# EAGLE design R220L (EAGLE 6.6.0)
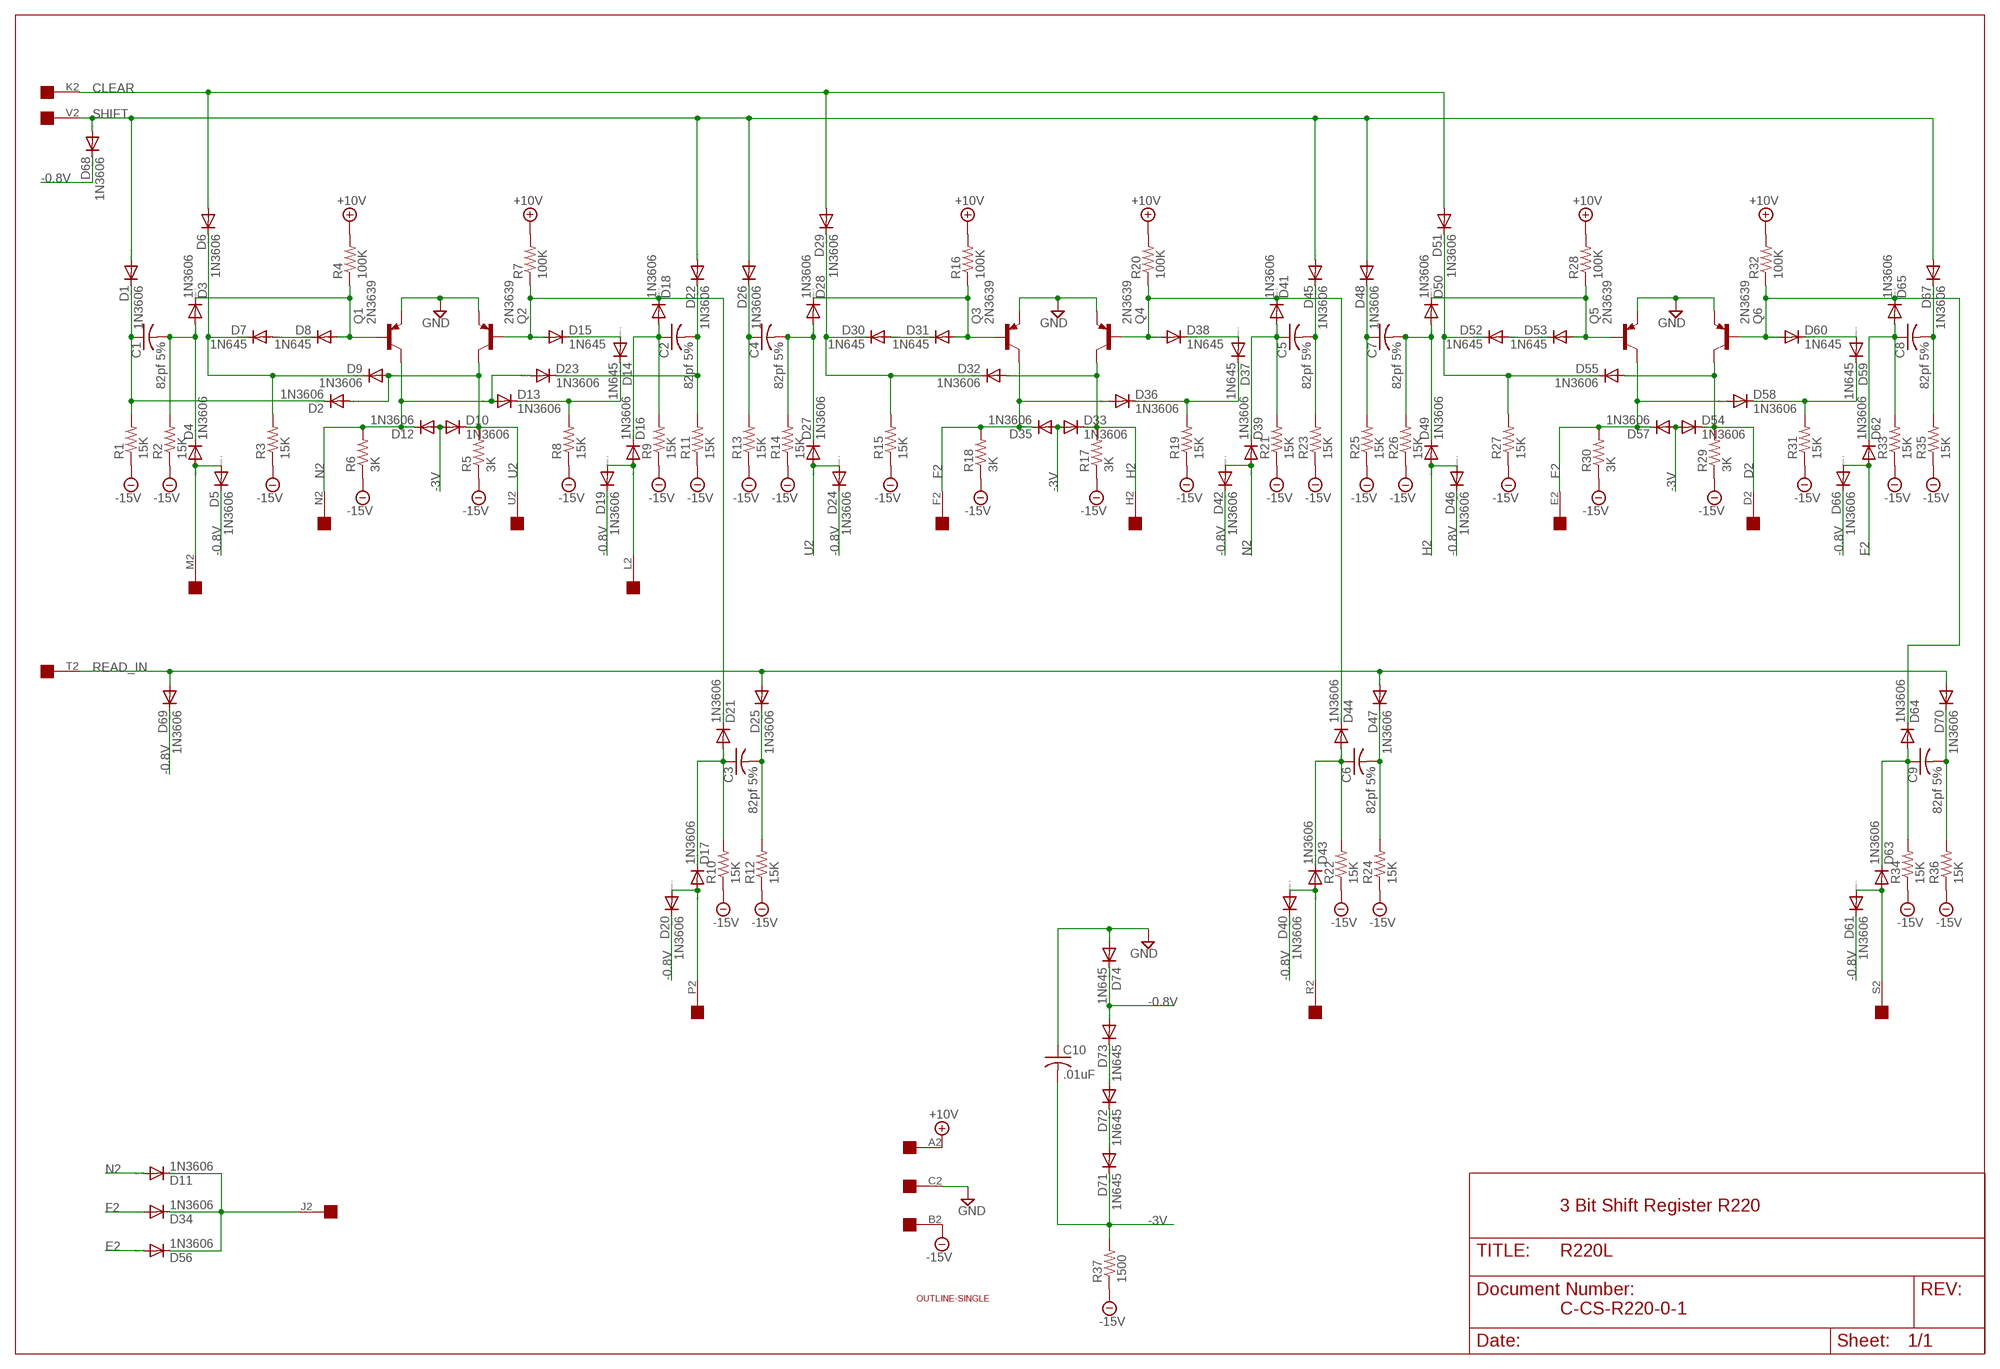
[diagram p0: schematic, sheet 1]

## Parts
C1  82pf 5%  C-US  [C063-025X075]
C2  82pf 5%  C-US  [C063-025X075]
C3  82pf 5%  C-US  [C063-025X075]
C4  82pf 5%  C-US  [C063-025X075]
C5  82pf 5%  C-US  [C063-025X075]
C6  82pf 5%  C-US  [C063-025X075]
C7  82pf 5%  C-US  [C063-025X075]
C8  82pf 5%  C-US  [C063-025X075]
C9  82pf 5%  C-US  [C063-025X075]
C10  .01uF  C-US  [C063-025X075]
D1  1N3606  1N4148DO35-10  [DO35-10]
D2  1N3606  1N4148DO35-10  [DO35-10]
D3  1N3606  1N4148DO35-10  [DO35-10]
D4  1N3606  1N4148DO35-10  [DO35-10]
D5  1N3606  1N4148DO35-10  [DO35-10]
D6  1N3606  1N4148DO35-10  [DO35-10]
D7  1N645  1N4148DO35-10  [DO35-10]
D8  1N645  1N4148DO35-10  [DO35-10]
D9  1N3606  1N4148DO35-10  [DO35-10]
D10  1N3606  1N4148DO35-10  [DO35-10]
D11  1N3606  1N4148DO35-10  [DO35-10]
D12  1N3606  1N4148DO35-10  [DO35-10]
D13  1N3606  1N4148DO35-10  [DO35-10]
D14  1N645  1N4148DO35-10  [DO35-10]
D15  1N645  1N4148DO35-10  [DO35-10]
D16  1N3606  1N4148DO35-10  [DO35-10]
D17  1N3606  1N4148DO35-10  [DO35-10]
D18  1N3606  1N4148DO35-10  [DO35-10]
D19  1N3606  1N4148DO35-10  [DO35-10]
D20  1N3606  1N4148DO35-10  [DO35-10]
D21  1N3606  1N4148DO35-10  [DO35-10]
D22  1N3606  1N4148DO35-10  [DO35-10]
D23  1N3606  1N4148DO35-10  [DO35-10]
D24  1N3606  1N4148DO35-10  [DO35-10]
D25  1N3606  1N4148DO35-10  [DO35-10]
D26  1N3606  1N4148DO35-10  [DO35-10]
D27  1N3606  1N4148DO35-10  [DO35-10]
D28  1N3606  1N4148DO35-10  [DO35-10]
D29  1N3606  1N4148DO35-10  [DO35-10]
D30  1N645  1N4148DO35-10  [DO35-10]
D31  1N645  1N4148DO35-10  [DO35-10]
D32  1N3606  1N4148DO35-10  [DO35-10]
D33  1N3606  1N4148DO35-10  [DO35-10]
D34  1N3606  1N4148DO35-10  [DO35-10]
D35  1N3606  1N4148DO35-10  [DO35-10]
D36  1N3606  1N4148DO35-10  [DO35-10]
D37  1N645  1N4148DO35-10  [DO35-10]
D38  1N645  1N4148DO35-10  [DO35-10]
D39  1N3606  1N4148DO35-10  [DO35-10]
D40  1N3606  1N4148DO35-10  [DO35-10]
D41  1N3606  1N4148DO35-10  [DO35-10]
D42  1N3606  1N4148DO35-10  [DO35-10]
D43  1N3606  1N4148DO35-10  [DO35-10]
D44  1N3606  1N4148DO35-10  [DO35-10]
D45  1N3606  1N4148DO35-10  [DO35-10]
D46  1N3606  1N4148DO35-10  [DO35-10]
D47  1N3606  1N4148DO35-10  [DO35-10]
D48  1N3606  1N4148DO35-10  [DO35-10]
D49  1N3606  1N4148DO35-10  [DO35-10]
D50  1N3606  1N4148DO35-10  [DO35-10]
D51  1N3606  1N4148DO35-10  [DO35-10]
D52  1N645  1N4148DO35-10  [DO35-10]
D53  1N645  1N4148DO35-10  [DO35-10]
D54  1N3606  1N4148DO35-10  [DO35-10]
D55  1N3606  1N4148DO35-10  [DO35-10]
D56  1N3606  1N4148DO35-10  [DO35-10]
D57  1N3606  1N4148DO35-10  [DO35-10]
D58  1N3606  1N4148DO35-10  [DO35-10]
D59  1N645  1N4148DO35-10  [DO35-10]
D60  1N645  1N4148DO35-10  [DO35-10]
D61  1N3606  1N4148DO35-10  [DO35-10]
D62  1N3606  1N4148DO35-10  [DO35-10]
D63  1N3606  1N4148DO35-10  [DO35-10]
D64  1N3606  1N4148DO35-10  [DO35-10]
D65  1N3606  1N4148DO35-10  [DO35-10]
D66  1N3606  1N4148DO35-10  [DO35-10]
D67  1N3606  1N4148DO35-10  [DO35-10]
D68  1N3606  1N4148DO35-10  [DO35-10]
D69  1N3606  1N4148DO35-10  [DO35-10]
D70  1N3606  1N4148DO35-10  [DO35-10]
D71  1N645  1N4148DO35-10  [DO35-10]
D72  1N645  1N4148DO35-10  [DO35-10]
D73  1N645  1N4148DO35-10  [DO35-10]
D74  1N645  1N4148DO35-10  [DO35-10]
Q1  2N3639  2N3637  [TO39]
Q2  2N3639  2N3637  [TO39]
Q3  2N3639  2N3637  [TO39]
Q4  2N3639  2N3637  [TO39]
Q5  2N3639  2N3637  [TO39]
Q6  2N3639  2N3637  [TO39]
R1  15K  R-US_0207/10  [0207/10]
R2  15K  R-US_0207/10  [0207/10]
R3  15K  R-US_0207/10  [0207/10]
R4  100K  R-US_0207/10  [0207/10]
R5  3K  R-US_0207/10  [0207/10]
R6  3K  R-US_0207/10  [0207/10]
R7  100K  R-US_0207/10  [0207/10]
R8  15K  R-US_0207/10  [0207/10]
R9  15K  R-US_0207/10  [0207/10]
R10  15K  R-US_0207/10  [0207/10]
R11  15K  R-US_0207/10  [0207/10]
R12  15K  R-US_0207/10  [0207/10]
R13  15K  R-US_0207/10  [0207/10]
R14  15K  R-US_0207/10  [0207/10]
R15  15K  R-US_0207/10  [0207/10]
R16  100K  R-US_0207/10  [0207/10]
R17  3K  R-US_0207/10  [0207/10]
R18  3K  R-US_0207/10  [0207/10]
R19  15K  R-US_0207/10  [0207/10]
R20  100K  R-US_0207/10  [0207/10]
R21  15K  R-US_0207/10  [0207/10]
R22  15K  R-US_0207/10  [0207/10]
R23  15K  R-US_0207/10  [0207/10]
R24  15K  R-US_0207/10  [0207/10]
R25  15K  R-US_0207/10  [0207/10]
R26  15K  R-US_0207/10  [0207/10]
R27  15K  R-US_0207/10  [0207/10]
R28  100K  R-US_0207/10  [0207/10]
R29  3K  R-US_0207/10  [0207/10]
R30  3K  R-US_0207/10  [0207/10]
R31  15K  R-US_0207/10  [0207/10]
R32  100K  R-US_0207/10  [0207/10]
R33  15K  R-US_0207/10  [0207/10]
R34  15K  R-US_0207/10  [0207/10]
R35  15K  R-US_0207/10  [0207/10]
R36  15K  R-US_0207/10  [0207/10]
R37  1500  R-US_0207/10  [0207/10]
U$1  OUTLINE-SINGLE  [SINGLE]
U$2  EDGE-1  [EDGE-CON1]

## Nets
+10V [Power]: R4.2 R7.2 R16.2 R20.2 R28.2 R32.2 U$2.A2
-0.8V [Power]: D5.C D19.C D20.C D24.C D40.C D42.C D46.C D61.C D66.C D68.C D69.C D73.A D74.C
-3V [Power]: C10.2 D10.A D12.A D33.A D35.A D54.A D57.A D71.C R37.2
-15V [Power]: R1.1 R2.1 R3.1 R5.1 R6.1 R8.1 R9.1 R10.1 R11.1 R12.1 R13.1 R14.1 R15.1 R17.1 R18.1 R19.1 R21.1 R22.1 R23.1 R24.1 R25.1 R26.1 R27.1 R29.1 R30.1 R31.1 R33.1 R34.1 R35.1 R36.1 R37.1 U$2.B2
CLEAR: D6.A D29.A D51.A U$2.K2
D2: D54.C D55.A Q6.3(C) R29.2 U$2.D2
E2: D56.A D57.C D58.A Q5.3(C) R30.2 U$2.E2
F2: D34.A D35.C D36.A D62.A D66.A Q3.3(C) R18.2 U$2.F2
GND [Power]: C10.1 D74.A Q1.1(E) Q2.1(E) Q3.1(E) Q4.1(E) Q5.1(E) Q6.1(E) U$2.C2
H2: D32.A D33.C D46.A D49.A Q4.3(C) R17.2 U$2.H2
N2: D11.A D12.C D13.A D23.A D39.A D42.A Q1.3(C) R6.2 U$2.N2
N$1: D30.A D31.C
N$2: C2.2 D22.C D23.C R11.2
N$3: D29.C D30.C D32.C R15.2
N$4: C1.1 D1.C D2.C R1.2
N$6: D14.A D15.C
N$7: C1.2 D3.A D4.C R2.2
N$8: C2.1 D16.C D18.A R9.2
N$9: D6.C D7.C D9.C R3.2
N$10: D4.A D5.A U$2.M2
N$11: D28.C D31.A Q3.2(B) R16.1
N$12: D13.C D14.C R8.2
N$13: D37.A D38.C
N$14: D3.C D8.A Q1.2(B) R4.1
N$15: D38.A D41.C D44.C Q4.2(B) R20.1
N$16: D36.C D37.C R19.2
N$17: D15.A D18.C D21.C Q2.2(B) R7.1
N$18: C4.1 D26.C R13.2
N$19: C4.2 D27.C D28.A R14.2
N$22: C5.1 D39.C D41.A R21.2
N$23: D7.A D8.C
N$24: D11.C D34.C D56.C U$2.J2
N$25: C5.2 D45.C R23.2
N$27: D52.A D53.C
N$28: D51.C D52.C D55.C R27.2
N$29: D50.C D53.A Q5.2(B) R28.1
N$30: D59.A D60.C
N$31: D60.A D64.C D65.C Q6.2(B) R32.1
N$32: D16.A D19.A U$2.L2
N$33: D58.C D59.C R31.2
N$34: C7.1 D48.C R25.2
N$35: C7.2 D49.C D50.A R26.2
N$36: D71.A D72.C
N$39: C8.1 D62.C D65.A R33.2
N$40: C8.2 D67.C R35.2
N$41: D72.A D73.C
N$43: C3.1 D17.C D21.A R10.2
N$44: C3.2 D25.C R12.2
N$46: C6.1 D43.C D44.A R22.2
N$47: C6.2 D47.C R24.2
N$50: C9.1 D63.C D64.A R34.2
N$51: C9.2 D70.C R36.2
P2: D17.A D20.A U$2.P2
R2: D40.A D43.A U$2.R2
READ_IN: D25.A D47.A D69.A D70.A U$2.T2
S2: D61.A D63.A U$2.S2
SHIFT: D1.A D22.A D26.A D45.A D48.A D67.A D68.A U$2.V2
U2: D2.A D9.A D10.C D24.A D27.A Q2.3(C) R5.2 U$2.U2

## Notes on the sheet
- 3 Bit Shift Register R220
- C-CS-R220-0-1

## Library data of the parts
C1-C10 = dec-con:C-US: Capacitors with funky DEC lead spacing.
D1-D74 = diode:1N4148: DIODE high speed (Philips)
Q1-Q6 = transistor-pnp:2N3637*: PNP Transistror
R1-R37 = rcl:R-US_: RESISTOR, American symbol
U$1 = dec-con:OUTLINE-*: Board outlines for DEC boards.
U$2 = dec-con:EDGE-1: Single-Sided DEC Edge Connector -- (side 2)

## Net classes
1 Power: width 0.813 mm

## Board
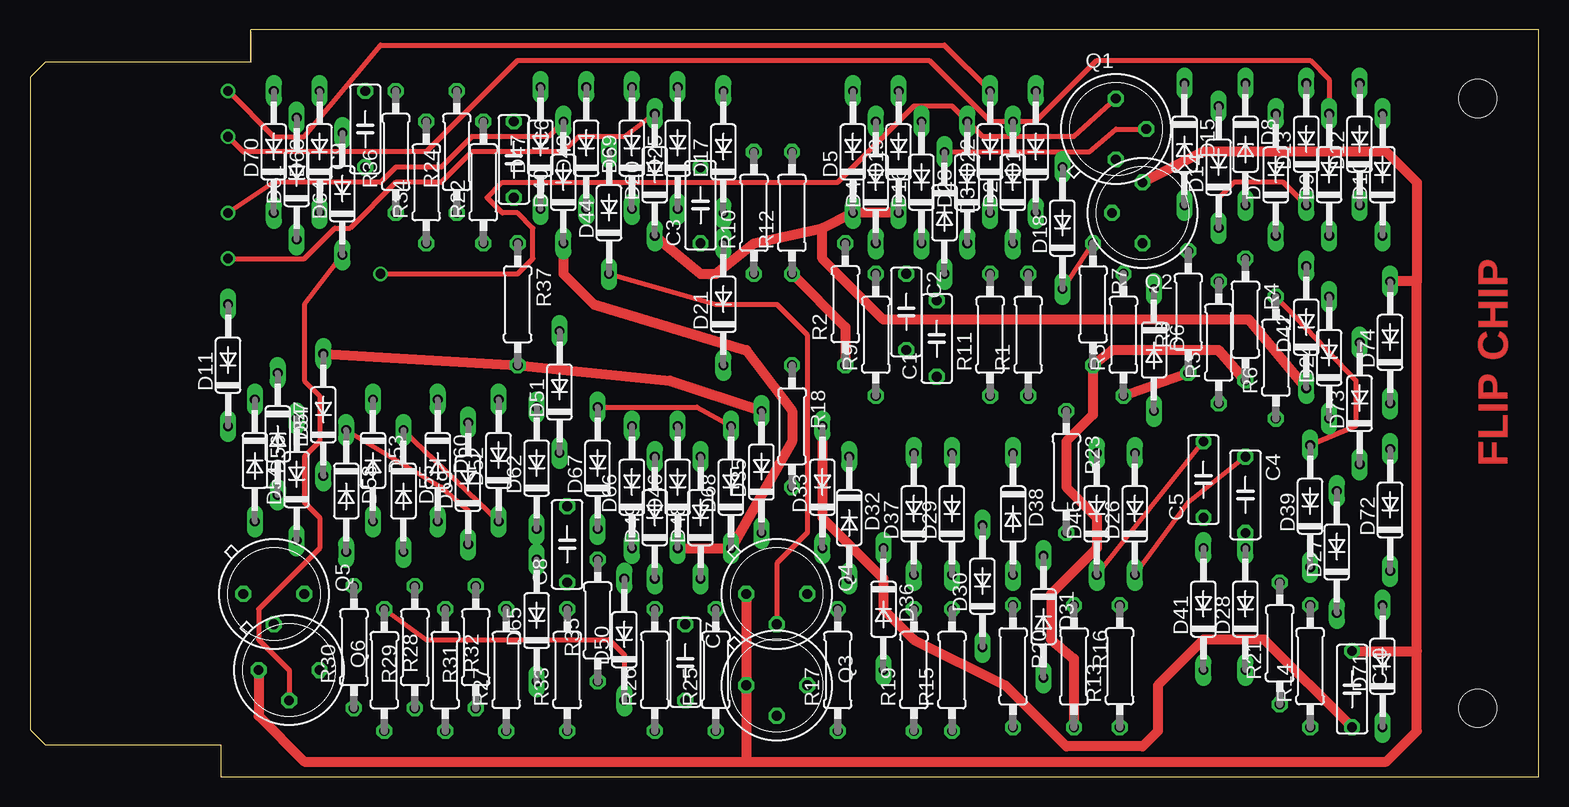
[diagram p1: board, top side]
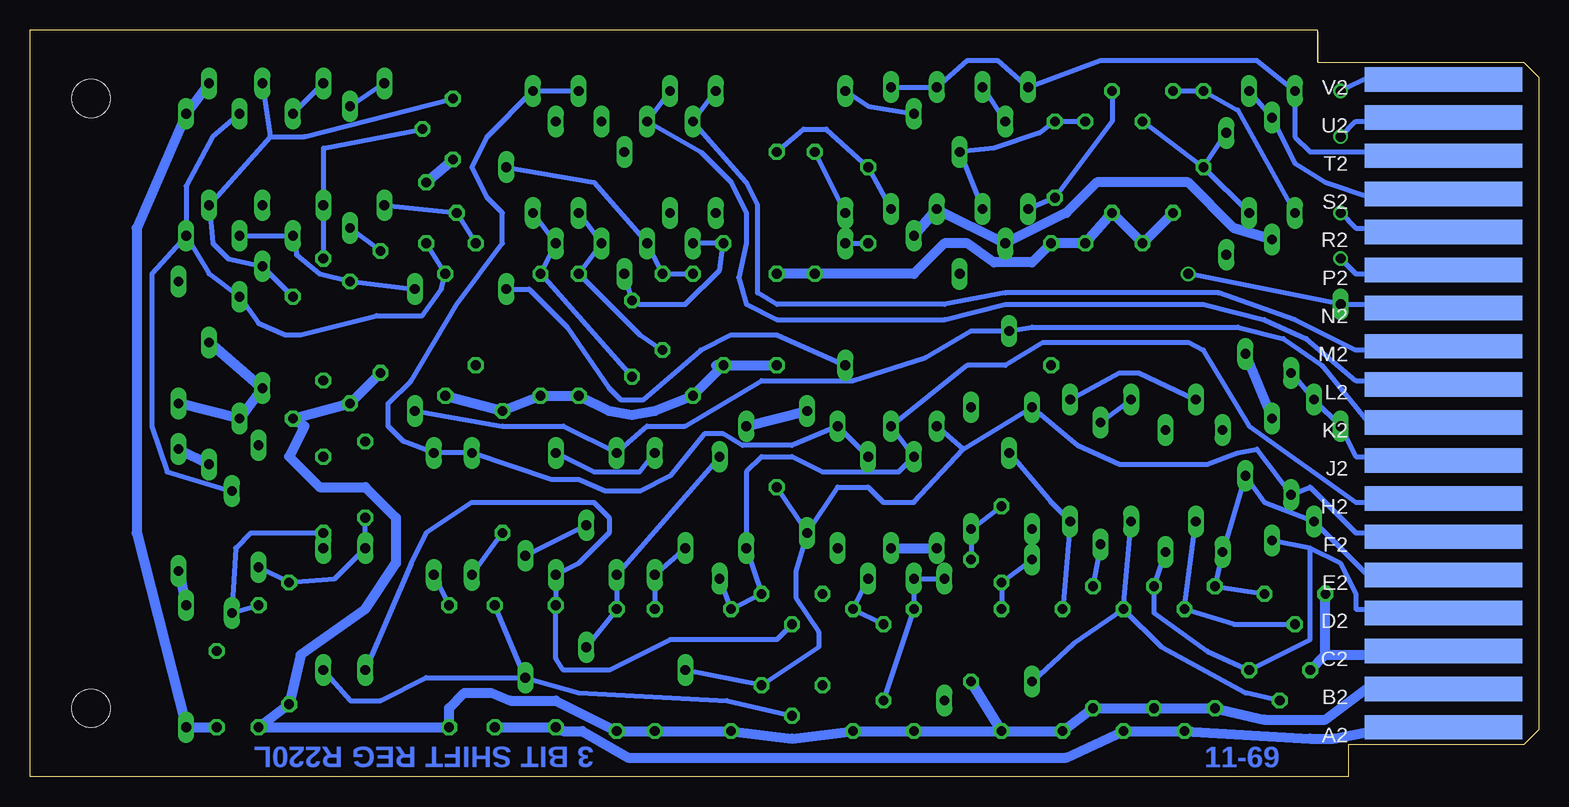
[diagram p2: board, bottom side, seen from below]

Size 125.73 x 62.23 mm. Coordinates in mm from the lower left corner, seen from the top.
Copper layers (1+16): Top 0.035mm / dielectric 1.5mm / Bottom 0.035mm
Design rules "16mils": minimum track width 16mil, minimum drill 32mil, track to track 15mil, track to pad 10mil, pad to pad 10mil, via to via 10mil, smd to smd 10mil, copper to edge 13mil, drill to drill 10mil, minimum pad ring 10mil, minimum via ring 8mil, stop-mask expansion 0mil, vias tented up to drill 0mil, thermal gap 10mil

### Footprints (pad centres in the part's own frame; a part is rotated, then mirrored left to right if it is on the bottom)
C063-025X075 = drill 0.813 octagon: 1 -2.54,0; 2 3.81,0
DO35-10 = drill 0.813 long: A 5.08,0; C -5.08,0
TO39 = drill 0.813 octagon: 1 0,-2.54; 2 2.54,0; 3 0,2.54
0207/10 = drill 0.813 octagon: 1 -5.08,0; 2 5.08,0
SINGLE = hole 3.175: 120.65,56.515; 120.65,5.715
EDGE-CON1 = smd 13.106 x 2.032 bottom: A2 7.938,4.128; B2 7.938,7.303; C2 7.938,10.477; D2 7.938,13.652; E2 7.938,16.828; F2 7.938,20.003; H2 7.938,23.177; J2 7.938,26.352; K2 7.938,29.527; L2 7.938,32.703; M2 7.938,35.877; N2 7.938,39.053; P2 7.938,42.227; R2 7.938,45.403; S2 7.938,48.578; T2 7.938,51.752; U2 7.938,54.928; V2 7.938,58.102

### Placement (x,y rotation side)
C1  75.57,35.88 90 top
C2  73.03,39.37 270 top
C3  55.88,46.99 90 top
C4  101.28,24.13 270 top
C5  97.79,24.13 90 top
C6  40.32,52.07 270 top
C7  54.61,10.16 270 top
C8  44.77,18.73 90 top
C9  27.94,53.34 90 top
C10  110.17,7.94 270 top
D1  83.82,52.07 90 top
D2  81.92,49.53 90 top
D3  76.2,46.99 270 top
D4  70.49,49.53 90 top
D5  68.58,52.07 90 top
D6  93.66,35.56 270 top
D7  103.82,50.16 90 top
D8  101.28,52.7 270 top
D9  108.27,50.16 90 top
D10  112.71,50.16 90 top
D11  16.51,34.29 90 top
D12  110.81,52.7 90 top
D13  106.36,52.7 90 top
D14  99.06,50.8 90 top
D15  96.2,52.7 270 top
D16  74.3,49.53 90 top
D17  57.79,52.07 90 top
D18  86.04,45.72 90 top
D19  72.39,52.07 90 top
D20  52.07,50.16 90 top
D21  57.79,39.37 90 top
D22  80.01,52.07 90 top
D23  78.11,49.53 90 top
D24  108.27,34.92 90 top
D25  53.98,52.39 90 top
D26  92.08,21.91 90 top
D27  108.9,18.73 90 top
D28  101.28,13.97 90 top
D29  76.84,21.91 90 top
D30  79.38,15.88 90 top
D31  84.46,13.34 270 top
D32  68.26,21.59 270 top
D33  66.04,24.13 90 top
D34  20.64,28.57 270 top
D35  60.96,25.4 90 top
D36  71.12,13.97 270 top
D37  73.66,21.91 90 top
D38  81.92,21.91 270 top
D39  106.68,22.54 90 top
D40  44.45,49.53 90 top
D41  97.79,13.97 90 top
D42  106.36,37.47 90 top
D43  46.36,52.39 90 top
D44  48.26,46.99 90 top
D45  88.9,21.91 90 top
D46  53.98,24.13 90 top
D47  42.55,52.39 90 top
D48  55.88,21.59 90 top
D49  52.07,21.59 90 top
D50  49.53,11.43 90 top
D51  44.13,32.07 90 top
D52  39.05,26.35 90 top
D53  28.58,26.35 270 top
D54  22.23,24.77 90 top
D55  31.12,23.81 270 top
D56  18.73,26.35 270 top
D57  24.45,30.16 90 top
D58  26.35,23.81 270 top
D59  36.51,24.45 90 top
D60  33.97,26.35 270 top
D61  22.23,49.85 90 top
D62  42.23,25.72 90 top
D63  24.13,52.07 90 top
D64  26.04,48.58 90 top
D65  42.23,13.02 90 top
D66  50.17,24.13 90 top
D67  47.31,25.72 90 top
D68  58.42,24.13 90 top
D69  50.17,52.39 90 top
D70  20.32,52.07 90 top
D71  112.71,9.21 90 top
D72  113.35,22.23 90 top
D73  110.81,31.11 90 top
D74  113.35,36.2 90 top
Q1  90.49,53.98 0 top
Q2  92.71,46.99 180 top
Q3  62.23,7.62 270 top
Q4  62.23,15.24 270 top
Q5  20.32,15.24 270 top
Q6  21.59,8.89 270 top
R1  83.19,36.83 90 top
R2  67.95,39.37 90 top
R3  99.06,36.2 90 top
R4  101.28,38.1 270 top
R5  91.12,36.83 90 top
R6  103.82,34.92 90 top
R7  88.58,39.37 270 top
R8  96.52,38.73 90 top
R9  70.49,36.83 90 top
R10  60.33,46.99 90 top
R11  80.01,36.83 90 top
R12  63.5,46.99 90 top
R13  90.81,9.21 90 top
R14  106.68,9.21 90 top
R15  76.84,8.89 90 top
R16  87,9.21 270 top
R17  67.31,8.89 90 top
R18  63.5,29.21 270 top
R19  73.66,8.89 90 top
R20  81.92,9.21 270 top
R21  104.14,11.11 90 top
R22  37.78,49.53 90 top
R23  86.36,25.4 270 top
R24  35.56,52.07 90 top
R25  57.15,8.89 90 top
R26  52.07,8.89 90 top
R27  39.69,8.89 90 top
R28  29.53,8.89 270 top
R29  32.07,10.79 90 top
R30  26.99,10.79 90 top
R31  37.15,10.79 90 top
R32  34.61,8.89 270 top
R33  44.77,8.89 90 top
R34  33.02,49.53 90 top
R35  47.31,13.02 90 top
R36  30.48,52.07 90 top
R37  40.64,39.37 270 top
U$1  0,0 0 top
U$2  0,0 0 top
U$3  [FLIPCHIP]  125.73,62.23 180 top

### Tracks (layer width: path | path; a pad name or v marks a point on that pad's centre or on a via)
+10V
  Top 0.813: R4.2 99.06,35.56 90.17,35.56 R7.2 88.58,30.16 86.36,27.94 86.36,24.13 88.9,21.59 88.9,19.05 85.09,15.24 85.09,11.43 87,9.84 R16.2
  Bottom 0.813: U$2.A2 8.89,4.19 8.89,3.81 13.97,3.81 17.15,3.17 19.05,3.17 R28.2 R32.2 39.37,1.59 75.88,1.59 79.69,3.81 81.28,3.81 R20.2 R16.2
-0.8V
  Top 0.813: D46.C D68.C 63.5,27.94 63.5,30.48 59.69,35.56 46.99,39.37 44.45,41.91 D40.C | D19.C D5.C 66.04,45.72 | D20.C 55.88,41.91 57.15,41.91 60.33,44.45 66.04,45.72 | D42.C 101.6,38.1 71.12,38.1 66.04,43.18 66.04,45.72
  Bottom 0.813: D46.C D66.C | D20.C D69.C D40.C 39.37,46.99 36.83,49.53 29.21,49.53 25.4,45.72 D61.C | D73.A D42.C D24.C D74.C
-3V
  Top 0.813: D57.A R37.2 53.34,33.02 D35.A | D33.A 66.04,21.59 71.12,16.51 71.12,13.97 73.66,11.43 81.28,7.62 83.82,5.08 86.36,2.54 92.71,2.54 93.98,3.81 93.98,7.62 97.79,11.43 102.87,11.43 C10.2
  Bottom 0.813: D57.A D54.A | C10.2 D71.C 116.84,20.32 116.84,45.72 D10.A D12.A | D33.A D35.A
-15V
  Top 0.813: R12.1 67.95,37.47 R2.1 | R5.1 R8.1
  Bottom 0.813: U$2.B2 8.6,7.33 8.89,7.62 13.97,7.62 17.78,4.76 22.86,4.76 R30.1 R29.1 R31.1 R27.1 R33.1 | R33.1 R35.1 | R33.1 R26.1 R25.1 62.23,3.17 R17.1 R19.1 R15.1 81.92,6.35 85.73,6.35 87.31,6.99 89.54,6.99 90.81,5.71 R13.1 R14.1 R21.1 103.19,10.16 97.79,13.97 95.25,17.78 95.25,21.59 97.79,24.13 101.6,24.13 104.14,26.67 102.87,29.21 R6.1 R3.1 R8.1 | R36.1 R34.1 R24.1 R22.1 R37.1 42.23,42.86 45.4,42.86 47.63,44.45 49.53,44.45 52.07,41.91 R10.1 R12.1 | R2.1 68.58,34.29 | R2.1 R18.1 | R2.1 R9.1 73.66,30.48 75.57,30.16 77.47,30.48 R11.1 R1.1 R23.1 R5.1
CLEAR
  Bottom 0.406: U$2.K2 8.89,29.21 13.97,29.21 18.1,34.29 21.27,36.51 25.08,37.47 42.23,37.47 D51.A 47.31,37.15 51.12,34.92 57.15,33.02 64.77,33.02 71.12,29.21 74.3,29.21 D29.A 81.28,29.21 86.36,29.21 D6.A
D2
  Bottom 0.406: U$2.D2 8.59,13.66 8.89,13.97 15.24,13.97 15.24,15.24 16.51,17.78 19.05,19.05 | 19.05,19.05 19.05,11.43 Q6.3 27.62,10.48 32.07,13.65 R29.2 D55.A | 19.05,19.05 D54.C
E2
  Bottom 0.406: U$2.E2 8.56,16.84 8.89,16.51 13.97,16.51 D56.A 22.86,22.86 D57.C D58.A R30.2 Q5.3
F2
  Bottom 0.406: U$2.F2 8.89,20.32 15.24,20.32 19.05,24.13 D34.A 23.5,27.3 25.08,26.99 27.62,26.04 34.93,26.04 38.42,27.62 D62.A 47.94,27.3 | D36.A Q3.3 60.01,10.79 60.01,12.06 61.91,14.92 61.91,17.14 D35.C | R18.2 D35.C | D35.C 58.42,24.13 55.88,24.13 54.61,22.86 52.07,22.86 47.94,27.3 | 47.94,27.3 D66.A
GND
  Top 0.813: 115.57,41.27 115.57,49.53 113.03,52.07 97.79,52.07 Q2.1 | 115.57,41.27 D74.A | C10.1 115.57,10.48 | 115.57,10.48 115.57,41.27 | Q6.1 19.05,5.08 22.86,1.27 59.69,1.27 | 59.69,1.27 113.03,1.27 115.57,3.81 115.57,10.48 | Q4.1 Q3.1 59.69,1.27
  Bottom 0.813: U$2.C2 8.56,10.49 8.89,10.16 17.78,10.16 | Q6.1 17.78,10.16 | 17.78,10.16 Q5.1 | Q2.1 Q1.1
H2
  Bottom 0.406: U$2.H2 10.16,22.86 15.24,22.86 24.13,29.21 27.94,35.56 29.21,36.2 41.28,36.2 44.45,34.29 47.63,34.29 D46.A D49.A 53.34,25.4 59.69,25.4 62.23,26.67 64.77,26.67 66.04,25.4 D33.C Q4.3 R17.2 D32.A
N2  (via drill 0.81)
  Top 0.406: R6.2 110.49,33.02 110.49,29.21 D39.A | v29.21,41.91 40.64,41.91 41.91,43.18 41.91,45.72 40.64,46.99 39.37,46.99 38.1,48.26 39.37,49.53 67.31,49.53 73.66,55.88 76.84,55.88 D23.A 79.38,53.34 87,53.34 Q1.3
  Bottom 0.406: U$2.N2 8.89,39.37 D11.A v29.21,41.91 | 105.73,53.34 D12.C 110.49,44.45 109.22,43.18 D42.A R6.2 | Q1.3 102.87,53.34 105.73,53.34 | D13.A 105.73,53.34
N$1
  Bottom 0.406: D31.C D30.A
N$2
  Bottom 0.406: C2.2 74.93,36.83 R11.2 D23.C D22.C
N$3
  Bottom 0.406: D30.C R15.2 D29.C D32.C
N$4
  Bottom 0.406: C1.1 R1.2 D2.C D1.C
N$6
  Bottom 0.406: D15.C D14.A
N$7
  Bottom 0.406: D4.C R2.2 68.26,42.23 71.12,39.37 74.93,39.37 C1.2 D3.A
N$8
  Bottom 0.406: R9.2 C2.1 D16.C 78.74,49.53 D18.A
N$9
  Bottom 0.406: D9.C D7.C 103.51,43.5 101.6,41.91 R3.2 D6.C
N$10
  Bottom 0.406: D5.A D4.A 66.04,49.53 65.09,47.62 65.09,40.32 63.5,39.37 49.53,39.37 44.45,40.32 26.67,40.32 20.32,38.1 15.24,35.56 10.16,35.56 U$2.M2
N$11
  Bottom 0.406: Q3.2 67.63,6.35 80.01,6.99 D31.A | D31.A 92.71,8.26 96.52,6.35 99.06,6.35 D28.C | D31.A R16.1
N$12
  Top 0.406: D14.C 99.06,48.26 100.33,49.53 104.46,49.53 D13.C
  Bottom 0.406: D14.C R8.2
N$13
  Bottom 0.406: D38.C 78.74,25.4 74.93,25.4 D37.A
N$14
  Top 0.406: D3.C 88.27,52.07 90.49,53.98 Q1.2
  Bottom 0.406: R4.1 D8.A 101.28,52.39 Q1.2
N$15
  Top 0.406: D44.C 57.15,39.37 62.23,39.37 64.77,36.83 64.77,20.32 62.23,17.78 Q4.2
  Bottom 0.406: D41.C 93.98,17.78 92.71,20.32 88.9,22.86 78.74,22.86 77.47,21.59 77.47,20.32 80.01,17.78 D38.A R20.1 81.92,9.84 81.28,8.89 77.47,8.89 72.39,11.43 63.5,11.43 Q4.2
N$16
  Bottom 0.406: D36.C D37.C R19.2
N$17
  Top 0.406: D18.C R7.1
  Bottom 0.406: R7.1 Q2.2 D15.A | D18.C 84.14,40.64 80.96,37.47 77.47,32.38 76.52,31.43 74.61,31.43 69.85,35.56 67.31,36.83 63.5,36.83 D21.C
N$18
  Top 0.406: D26.C 96.52,22.86 C4.1
  Bottom 0.406: D26.C R13.2
N$19
  Bottom 0.406: R14.2 D27.C 108.59,19.05 107.32,20.32 C4.2 D28.A
N$22
  Bottom 0.406: C5.1 D41.A 100.33,16.51 R21.2 D39.C
N$23
  Bottom 0.406: D8.C D7.A
N$24
  Bottom 0.406: U$2.J2 8.89,26.67 15.24,26.67 D11.C D56.C D34.C
N$25
  Top 0.406: C5.2 D45.C
  Bottom 0.406: R23.2 D45.C
N$27
  Bottom 0.406: D52.A 34.93,33.66 33.34,33.66 D53.C
N$28
  Top 0.406: D55.C D52.C
  Bottom 0.406: R27.2 D52.C 40.64,22.86 D51.C
N$29
  Top 0.406: R28.1 33.02,11.43 48.26,11.43 49.53,10.16 D50.C
  Bottom 0.406: Q5.2 25.4,12.7 R28.1 D53.A
N$30
  Bottom 0.406: D59.A D60.C
N$31
  Top 0.406: D64.C 22.86,39.37 22.86,33.02 24.13,31.75 24.13,27.94 22.86,26.67 22.86,22.86 24.13,21.59 24.13,19.05 19.05,13.97 19.05,11.43 21.59,8.89 Q6.2
  Bottom 0.406: R32.1 D60.A | Q6.2 24.45,6.99 31.43,10.79 R32.1 | D65.C 38.74,11.11 R32.1
N$32
  Bottom 0.406: U$2.L2 8.89,33.02 15.24,33.02 19.37,36.51 22.86,38.1 27.94,39.37 44.45,39.37 49.53,38.1 63.5,38.1 66.04,39.37 66.68,41.59 66.04,44.45 66.04,46.99 67.31,49.53 69.85,52.07 D16.A D19.A
N$33
  Top 0.406: D58.C 34.29,24.13 36.51,22.23 D59.C
  Bottom 0.406: D59.C R31.2
N$34
  Bottom 0.406: C7.1 R25.2 D48.C
N$35
  Bottom 0.406: C7.2 R26.2 D49.C D50.A
N$36
  Bottom 0.813: D72.C D71.A
N$39
  Bottom 0.406: R33.2 C8.1 D65.A D62.C
N$40
  Bottom 0.406: R35.2 D67.C C8.2
N$41
  Bottom 0.813: D72.A D73.C
N$43
  Bottom 0.406: R10.2 D17.C D21.A C3.1
N$44
  Bottom 0.406: D25.C C3.2 59.37,53.98 61.28,53.98 R12.2
N$46
  Bottom 0.406: R22.2 C6.1 41.59,53.66 45.4,52.39 D44.A D43.C
N$47
  Bottom 0.406: R24.2 35.56,54.61 C6.2 D47.C
N$50
  Bottom 0.406: C9.1 D64.A | R34.2 C9.1 | C9.1 D63.C
N$51
  Bottom 0.406: R36.2 C9.2 25.08,55.56 D70.C
P2  (via drill 0.81)
  Top 0.406: v16.51,43.18 22.86,43.18 25.4,45.72 26.67,45.72 30.48,49.53 34.29,49.53 36.83,52.07 44.45,52.07 45.72,53.34 49.53,53.34 D20.A
  Bottom 0.406: U$2.P2 8.89,41.91 15.24,41.91 v16.51,43.18 | D20.A 55.88,55.88 D17.A
R2  (via drill 0.81)
  Top 0.406: v16.51,46.99 20.32,49.53 29.21,49.53 30.48,50.8 34.29,50.8 36.83,53.34 43.18,53.34 D40.A
  Bottom 0.406: U$2.R2 10.16,45.72 15.24,45.72 v16.51,46.99 | D43.A D40.A
READ_IN
  Bottom 0.406: U$2.T2 8.89,52.07 19.05,52.07 20.32,53.34 D70.A 23.5,59.69 36.51,59.69 D47.A 45.09,59.69 47.63,59.69 D69.A D25.A
S2
  Bottom 0.406: U$2.S2 8.89,48.26 13.97,48.26 17.78,49.53 20.32,51.12 D61.A D63.A
SHIFT  (via drill 0.81)
  Top 0.406: v16.51,57.15 20.32,53.34 22.86,53.34 29.21,60.96 76.2,60.96 D22.A | D67.A 55.56,30.8 D68.A
  Bottom 0.406: D22.A D1.A 87.63,53.34 88.9,50.8 87.63,48.26 86.36,46.99 86.36,44.45 90.17,39.37 93.98,33.02 95.89,31.11 95.89,29.21 94.62,27.94 D26.A D45.A 82.23,24.77 80.01,24.77 77.79,23.81 74.93,23.81 72.39,25.08 69.53,28.57 67.95,28.57 66.36,27.62 62.23,27.62 D68.A D48.A | U$2.V2 10.16,58.42 13.97,58.42 v16.51,57.15
U2  (via drill 0.81)
  Top 0.406: v16.51,53.34 17.78,52.07 33.02,52.07 40.64,59.69 74.93,59.69 80.01,54.61 D2.A 83.82,54.61 88.9,59.69 106.68,59.69 108.27,58.1 D9.A
  Bottom 0.406: U$2.U2 8.89,54.61 15.24,54.61 v16.51,53.34 | D10.C 110.81,41.91 D24.A 106.68,37.78 104.46,36.83 103.19,36.83 96.84,38.42 93.03,38.42 91.44,40.64 R5.2 Q2.3 | D10.C 115.57,41.91 115.57,29.21 114.3,25.4 D27.A | D9.A 110.49,53.34 112.71,49.21 D10.C

### Text on the board
Bottom: 11-69 | 3 BIT SHIFT REG R220L